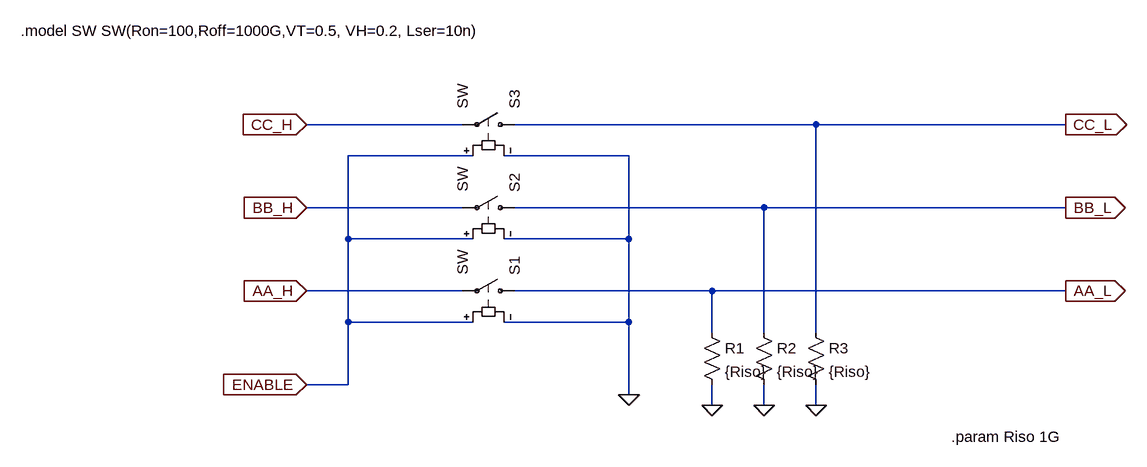
[diagram p0: schematic LowSide.asc]
LowSide.asc, the LTspice schematic file:
Version 4
SHEET 1 1208 680
WIRE 160 -48 -80 -48
WIRE 704 -48 240 -48
WIRE 1088 -48 704 -48
WIRE 176 0 -16 0
WIRE 416 0 224 0
WIRE 160 80 -80 80
WIRE 624 80 240 80
WIRE 1088 80 624 80
WIRE -16 128 -16 0
WIRE 176 128 -16 128
WIRE 416 128 416 0
WIRE 416 128 224 128
WIRE 160 208 -80 208
WIRE 544 208 240 208
WIRE 1088 208 544 208
WIRE -16 256 -16 128
WIRE 176 256 -16 256
WIRE 416 256 416 128
WIRE 416 256 224 256
WIRE 544 272 544 208
WIRE 624 272 624 80
WIRE 704 272 704 -48
WIRE -16 352 -16 256
WIRE -16 352 -80 352
WIRE 416 368 416 256
WIRE 544 384 544 352
WIRE 624 384 624 352
WIRE 704 384 704 352
FLAG -80 208 AA_H
IOPIN -80 208 In
FLAG -80 80 BB_H
IOPIN -80 80 In
FLAG -80 -48 CC_H
IOPIN -80 -48 In
FLAG 1088 208 AA_L
IOPIN 1088 208 Out
FLAG 1088 80 BB_L
IOPIN 1088 80 Out
FLAG 1088 -48 CC_L
IOPIN 1088 -48 Out
FLAG 416 368 0
FLAG -80 352 ENABLE
IOPIN -80 352 In
FLAG 544 384 0
FLAG 624 384 0
FLAG 704 384 0
SYMBOL sw 256 208 M270
SYMATTR InstName S1
SYMBOL sw 256 80 M270
SYMATTR InstName S2
SYMBOL sw 256 -48 M270
SYMATTR InstName S3
SYMBOL res 528 256 R0
SYMATTR InstName R1
SYMATTR Value {Riso}
SYMBOL res 608 256 R0
SYMATTR InstName R2
SYMATTR Value {Riso}
SYMBOL res 688 256 R0
SYMATTR InstName R3
SYMATTR Value {Riso}
TEXT -520 -192 Left 2 !.model SW SW(Ron=100,Roff=1000G,VT=0.5, VH=0.2, Lser=10n)
TEXT 912 432 Left 2 !.param Riso 1G

The netlist it stands for:
* LowSide.asc
S1 AA_L AA_H ENABLE 0 SW
S2 BB_L BB_H ENABLE 0 SW
S3 CC_L CC_H ENABLE 0 SW
R1 AA_L 0 {Riso}
R2 BB_L 0 {Riso}
R3 CC_L 0 {Riso}
.model SW SW(Ron=100,Roff=1000G,VT=0.5, VH=0.2, Lser=10n)
.param Riso 1G
.backanno
.end